# Altium schematic sheet RECEPTOR_AIS_DEMOD_R00.SchDoc
size A4; SheetNumber: 3; SheetTotal: 5
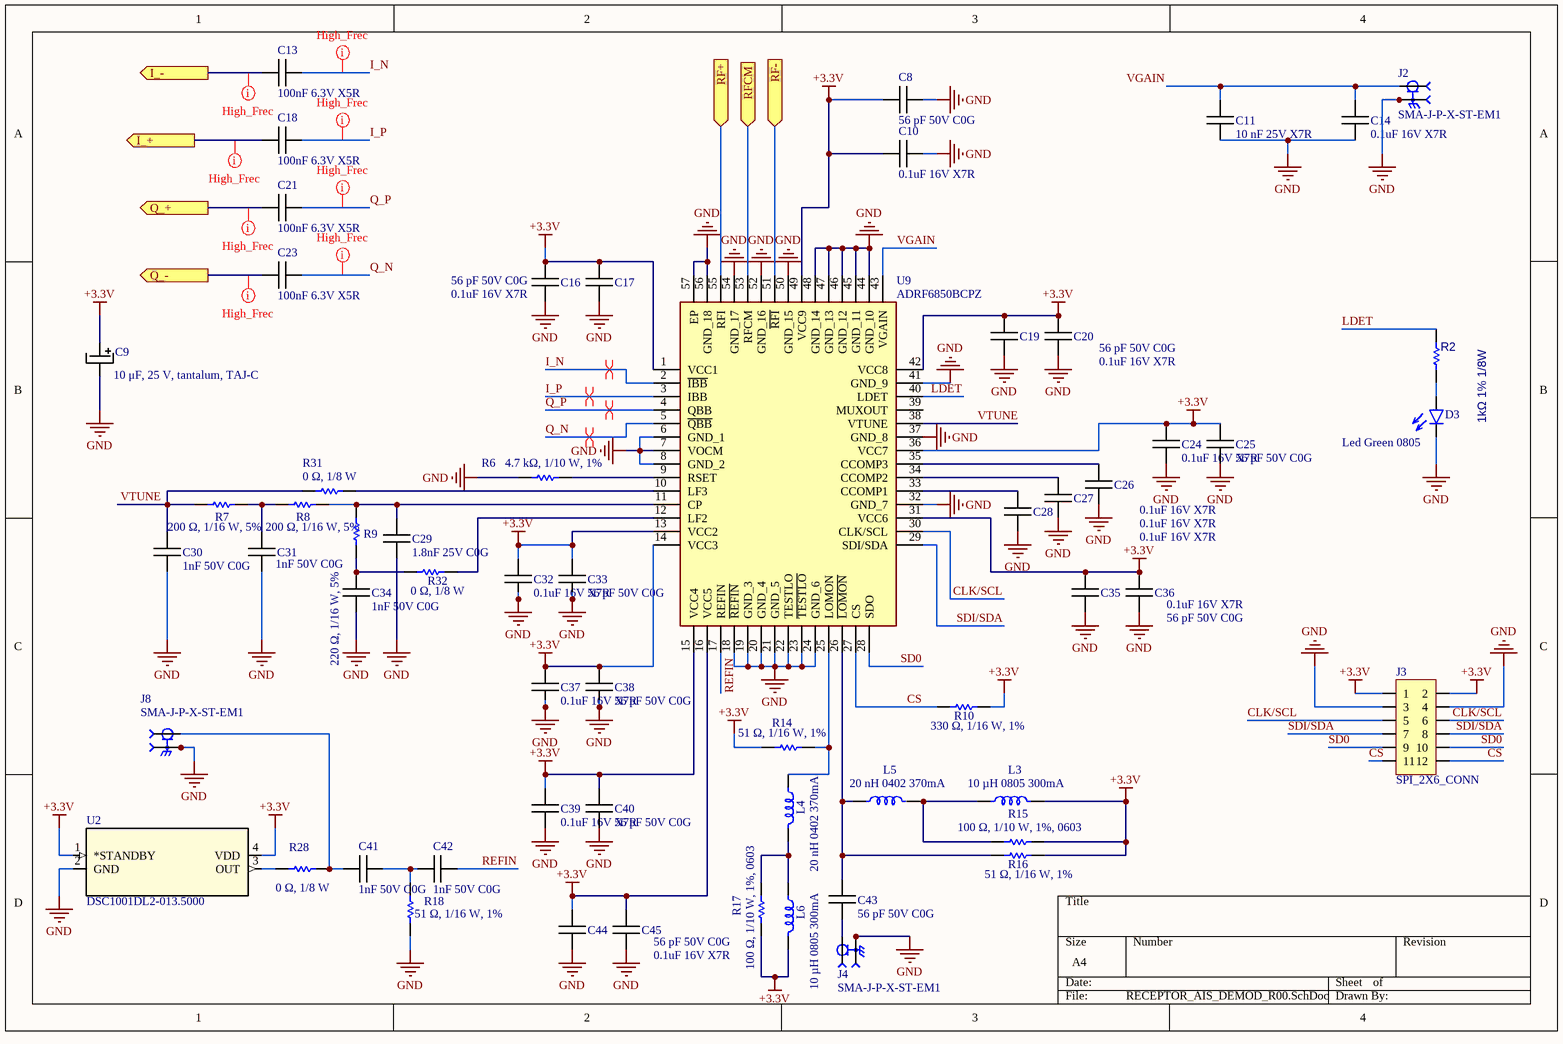
[diagram p0: RECEPTOR_AIS_DEMOD_R00.SchDoc]

## Parts
C8  56 pF 50V C0G  [C_0603]
C9  10 μF, 25 V, tantalum, TAJ-C  [TAJC_AVX-M]
C10  0.1uF 16V X7R  [C_0603]
C11  10 nF 25V X7R  [C_0603]
C13  100nF 6.3V X5R  [C_0603]
C14  0.1uF 16V X7R  [C_0603]
C16  0.1uF 16V X7R  [C_0603]
C17  56 pF 50V C0G  [C_0603]
C18  100nF 6.3V X5R  [C_0603]
C19  0.1uF 16V X7R  [C_0603]
C20  56 pF 50V C0G  [C_0603]
C21  100nF 6.3V X5R  [C_0603]
C23  100nF 6.3V X5R  [C_0603]
C24  0.1uF 16V X7R  [C_0603]
C25  56 pF 50V C0G  [C_0603]
C26  0.1uF 16V X7R  [C_0603]
C27  0.1uF 16V X7R  [C_0603]
C28  0.1uF 16V X7R  [C_0603]
C29  1.8nF 25V C0G  [C_0603]
C30  1nF 50V C0G  [C_0603]
C31  1nF 50V C0G  [C_0603]
C32  0.1uF 16V X7R  [C_0603]
C33  56 pF 50V C0G  [C_0603]
C34  1nF 50V C0G  [C_0603]
C35  0.1uF 16V X7R  [C_0603]
C36  56 pF 50V C0G  [C_0603]
C37  0.1uF 16V X7R  [C_0603]
C38  56 pF 50V C0G  [C_0603]
C39  0.1uF 16V X7R  [C_0603]
C40  56 pF 50V C0G  [C_0603]
C41  1nF 50V C0G  [C_0603]
C42  1nF 50V C0G  [C_0603]
C43  56 pF 50V C0G  [C_0603]
C44  0.1uF 16V X7R  [C_0603]
C45  56 pF 50V C0G  [C_0603]
D3  Led Green 0805  [LED_0805]
J2  SMA-J-P-X-ST-EM1  [CONN_SMA-J-P-H-ST-EM1_SAI]
J3  SPI_2X6_CONN  [Pin_Header_2x6]
J4  SMA-J-P-X-ST-EM1  [CONN_SMA-J-P-H-ST-EM1_SAI]
J8  SMA-J-P-X-ST-EM1  [CONN_SMA-J-P-H-ST-EM1_SAI]
L3  10 µH 0805 300mA  [L_0603]
L4  20 nH 0402 370mA  [L_0402]
L5  20 nH 0402 370mA  [L_0402]
L6  10 µH 0805 300mA  [L_0603]
R2  1kΩ 1% 1/8W  [R_0603]
R6  4.7 kΩ, 1/10 W, 1%  [R_0603]
R7  200 Ω, 1/16 W, 5%  [R_0603]
R8  200 Ω, 1/16 W, 5%  [R_0603]
R9  220 Ω, 1/16 W, 5%  [R_0603]
R10  330 Ω, 1/16 W, 1%  [R_0805]
R14  51 Ω, 1/16 W, 1%  [R_0805]
R15  100 Ω, 1/10 W, 1%, 0603  [R_0603]
R16  51 Ω, 1/16 W, 1%  [R_0805]
R17  100 Ω, 1/10 W, 1%, 0603  [R_0603]
R18  51 Ω, 1/16 W, 1%  [R_0805]
R28  0 Ω, 1/8 W  [R_0603]
R31  0 Ω, 1/8 W  [R_0603]
R32  0 Ω, 1/8 W  [R_0603]
U2  DSC1001DL2-013.5000  [CDFN4_2P5X2_MCH]
U9  ADRF6850BCPZ  [QFN50P800X800X100-57N-D]

## Ports
I_+ (out, see RECEPTOR_AIS_BLK_R00[3A], RECEPTOR_AIS_FI_R00[1B]), I_- (out, see RECEPTOR_AIS_BLK_R00[3B], RECEPTOR_AIS_FI_R00[1B]), Q_+ (out, see RECEPTOR_AIS_BLK_R00[3B], RECEPTOR_AIS_FI_R00[1C]), Q_- (out, see RECEPTOR_AIS_BLK_R00[3B], RECEPTOR_AIS_FI_R00[1C]), RF+ (in, see RECEPTOR_AIS_BLK_R00[2A], RECEPTOR_AIS_HF_R00[4C]), RF- (in, see RECEPTOR_AIS_BLK_R00[2B], RECEPTOR_AIS_HF_R00[4B]), RFCM (in, see RECEPTOR_AIS_BLK_R00[2B], RECEPTOR_AIS_HF_R00[4C])

## Nets
+3.3V: C8.1 C9.1 C10.1 C16.1 C17.1 C19.1 C20.1 C24.1 C25.1 C32.1 C33.1 C35.1 C36.1 C37.1 C38.1 C39.1 C40.1 C44.1 C45.1 J3.1 J3.2 L3.2 L6.2 R10.2 R14.2 R15.2 R16.2 R17.2 U2.1(*STANDBY) U2.4(VDD) U9.1(VCC1) U9.13(VCC2) U9.14(VCC3) U9.15(VCC4) U9.16(VCC5) U9.31(VCC6) U9.36(VCC7) U9.42(VCC8) U9.49(VCC9)
GND: C8.2 C9.2 C10.2 C11.2 C14.2 C16.2 C17.2 C19.2 C20.2 C24.2 C25.2 C26.2 C27.2 C28.2 C29.2 C30.2 C31.2 C32.2 C33.2 C34.2 C35.2 C36.2 C37.2 C38.2 C39.2 C40.2 C44.2 C45.2 D3.2(K) J2.2 J2.3 J3.3 J3.4 J4.2 J4.3 J8.2 J8.3 R6.2 R18.2 U2.2(GND) U9.6(GND_1) U9.7(VOCM) U9.8(GND_2) U9.18(~{REFIN}) U9.19(GND_3) U9.20(GND_4) U9.21(GND_5) U9.22(TESTLO) U9.23(~{TESTLO}) U9.24(GND_6) U9.32(GND_7) U9.37(GND_8) U9.41(GND_9) U9.44(GND_10) U9.45(GND_11) U9.46(GND_12) U9.47(GND_13) U9.48(GND_14) U9.50(GND_15) U9.52(GND_16) U9.54(GND_17) U9.56(GND_18) U9.57(EP)
CLK/SCL: J3.5 J3.6 U9.30(CLK/SCL)
CS: J3.11 J3.12 R10.1 U9.27(CS)
I_+: C18.2 ; port I_+
I_-: C13.2 ; port I_-
I_N: C13.1 U9.2(~{IBB})
I_P: C18.1 U9.3(IBB)
LDET: R2.2 U9.40(LDET)
Q_+: C21.2 ; port Q_+
Q_-: C23.2 ; port Q_-
Q_N: C23.1 U9.5(~{QBB})
Q_P: C21.1 U9.4(QBB)
REFIN: C42.1 U9.17(REFIN)
RF+: U9.55(RFI) ; port RF+
RF-: U9.51(~{RFI}) ; port RF-
RFCM: U9.53(RFCM) ; port RFCM
SD0: J3.9 J3.10 U9.28(SDO)
SDI/SDA: J3.7 J3.8 U9.29(SDI/SDA)
VGAIN: C11.1 C14.1 J2.1 U9.43(VGAIN)
VTUNE: C30.1 R7.2 R31.1 U9.38(VTUNE)
NetC26_1: C26.1 U9.35(CCOMP3)
NetC27_1: C27.1 U9.34(CCOMP2)
NetC28_1: C28.1 U9.33(CCOMP1)
NetC29_1: C29.1 R8.1 R9.1 U9.11(CP)
NetC31_1: C31.1 R7.1 R8.2
NetC34_1: C34.1 R9.2 R32.1
NetC41_1: C41.1 J8.1 R28.2
NetC41_2: C41.2 C42.2 R18.1
NetC43_1: C43.1 L5.1 R16.1 U9.26(~{LOMON})
NetC43_2: C43.2 J4.1
NetD3_1: D3.1(A) R2.1
NetL3_1: L3.1 L5.2 R15.1
NetL4_1: L4.1 R14.1 U9.25(LOMON)
NetL4_2: L4.2 L6.1 R17.1
NetR6_1: R6.1 U9.9(RSET)
NetR28_1: R28.1 U2.3(OUT)
NetR31_2: R31.2 U9.10(LF3)
NetR32_2: R32.2 U9.12(LF2)

Not connected (* = marked no-connect by the designer): U9 39(MUXOUT)

## Layout directives
net class RF_50Ohm: I_+, I_-, I_N, I_P, Q_+, Q_-, Q_N, Q_P
differential pair: I_N, I_P, Q_N, Q_P

## Library data of the parts
C8 C17 C20 C25 C33 C36 C38 C40 C43 C45 = Capacitor NP: 56 pF ±5% 50V Ceramic Capacitor C0G, NP0 0603 (1608 Metric)
C9 = Capacitor Pol: 10 µF Molded Tantalum Capacitors 25 V 2312 (6032 Metric) 1.8Ohm
C10 C14 C16 C19 C24 C26-C28 C32 C35 C37 C39 C44 = Capacitor NP: 0.1 µF ±10% 16V Ceramic Capacitor X7R 0603 (1608 Metric)
C11 = Capacitor NP: 10000 pF ±10% 25V Ceramic Capacitor X7R 0603 (1608 Metric)
C13 C18 C21 C23 = Capacitor NP: 0.1 µF ±10% 6.3V Ceramic Capacitor X5R 0603 (1608 Metric)
C29 = Capacitor NP: 1800 pF ±5% 25V Ceramic Capacitor C0G, NP0 0603 (1608 Metric)
C30 C31 C34 C41 C42 = Capacitor NP: 1000 pF ±5% 50V Ceramic Capacitor C0G, NP0 0603 (1608 Metric)
D3 = Led: Green 569nm LED Indication - Discrete 2.1V 0805 (2012 Metric)
J2 J4 J8 = SMA-J-P-X-ST-EM1: SMA Connector Jack, Female Socket 50 Ohms Board Edge, Cutout; Surface Mount Solder; MF: Samtec; MP: SMA-J-P-H-ST-EM3; SnapEDA_Link: https://www.snapeda.com/parts/SMA-J-P-H-ST-EM3/Samtec+Inc./view-part/?ref=snap; Package: None; Value: *; Check_prices: https://www.snapeda.com/parts/SMA-J-P-H-ST-EM3/Samtec+Inc./view-part/?ref=eda
J3 = SPI_2x6Pin_Connection
L3 L6 = IND: LQM18DN100M70L - 10 µH Shielded Multilayer Inductor 300 mA 1.365Ohm Max 0603 (1608 Metric)
L4 L5 = IND: LQW15AN20NJ00D - 20 nH Unshielded Wirewound Inductor 370 mA 270mOhm Max 0402 (1005 Metric)
R2 = Res1: 100 Ohms ±0.1% 1/8W Chip Resistor 0603 (1608 Metric) Thin Film
R6 = Res1: 4.7 kOhms ±1% 0.1W, 1/10W Chip Resistor 0603 (1608 Metric) Moisture Resistant Thick Film
R7 R8 = Res1: 200 Ohms ±5% 0.1W, 1/10W Chip Resistor 0603 (1608 Metric) Moisture Resistant Thick Film
R9 = Res1: 220 Ohms ±5% 0.1W, 1/10W Chip Resistor 0603 (1608 Metric) Moisture Resistant Thick Film
R10 = Res1: 330 Ohms ±1% 0.125W, 1/8W Chip Resistor 0805 (2012 Metric) Moisture Resistant Thick Film
R14 R16 R18 = Res1: CR0805-FX-51R0ELF - 51 Ohms ±1% 0.125W, 1/8W Chip Resistor 0805 (2012 Metric) Moisture Resistant Thick Film
R15 R17 = Res1: 100 Ohms ±1% 0.1W, 1/10W Chip Resistor 0603 (1608 Metric) Moisture Resistant Thick Film
R28 R31 R32 = Res1: CR0805-FX-51R0ELF - 0 Ohms Jumper 0.125W, 1/8W Chip Resistor 0603 (1608 Metric) Automotive AEC-Q200 Thick Film
U2 = DSC1001DL2-013.5000: 13.5 MHz XO (Standard) CMOS Oscillator 1.7V ~ 3.6V Standby (Power Down) 4-VDFN; Manufacturer_Name: Microchip; Copyright: Copyright (C) 2026 Ultra Librarian. All rights reserved.; Manufacturer_Part_Number: DSC1001DL2-013.5000; RefDes: RefDes; Type: Type
U9 = ADRF6850BCPZ: ADRF6850BCPZ, Demodulator Quadrature 250MHz 3.15  3.45 V 56-Pin LFCSP VQ; Manufacturer_Name: Analog Devices; Geometry.Height: 1mm; Mouser Part Number: 584-ADRF6850BCPZ; Mouser Price/Stock: https://www.mouser.co.uk/ProductDetail/Analog-Devices/ADRF6850BCPZ?qs=WIvQP4zGanhitN%252B3d2%252BYqw%3D%3D; Manufacturer_Part_Number: ADRF6850BCPZ; Datasheet Link: https://componentsearchengine.com/Datasheets/2/ADRF6850BCPZ.pdf